# EAGLE board mmu6100cp (EAGLE 6.6.0)
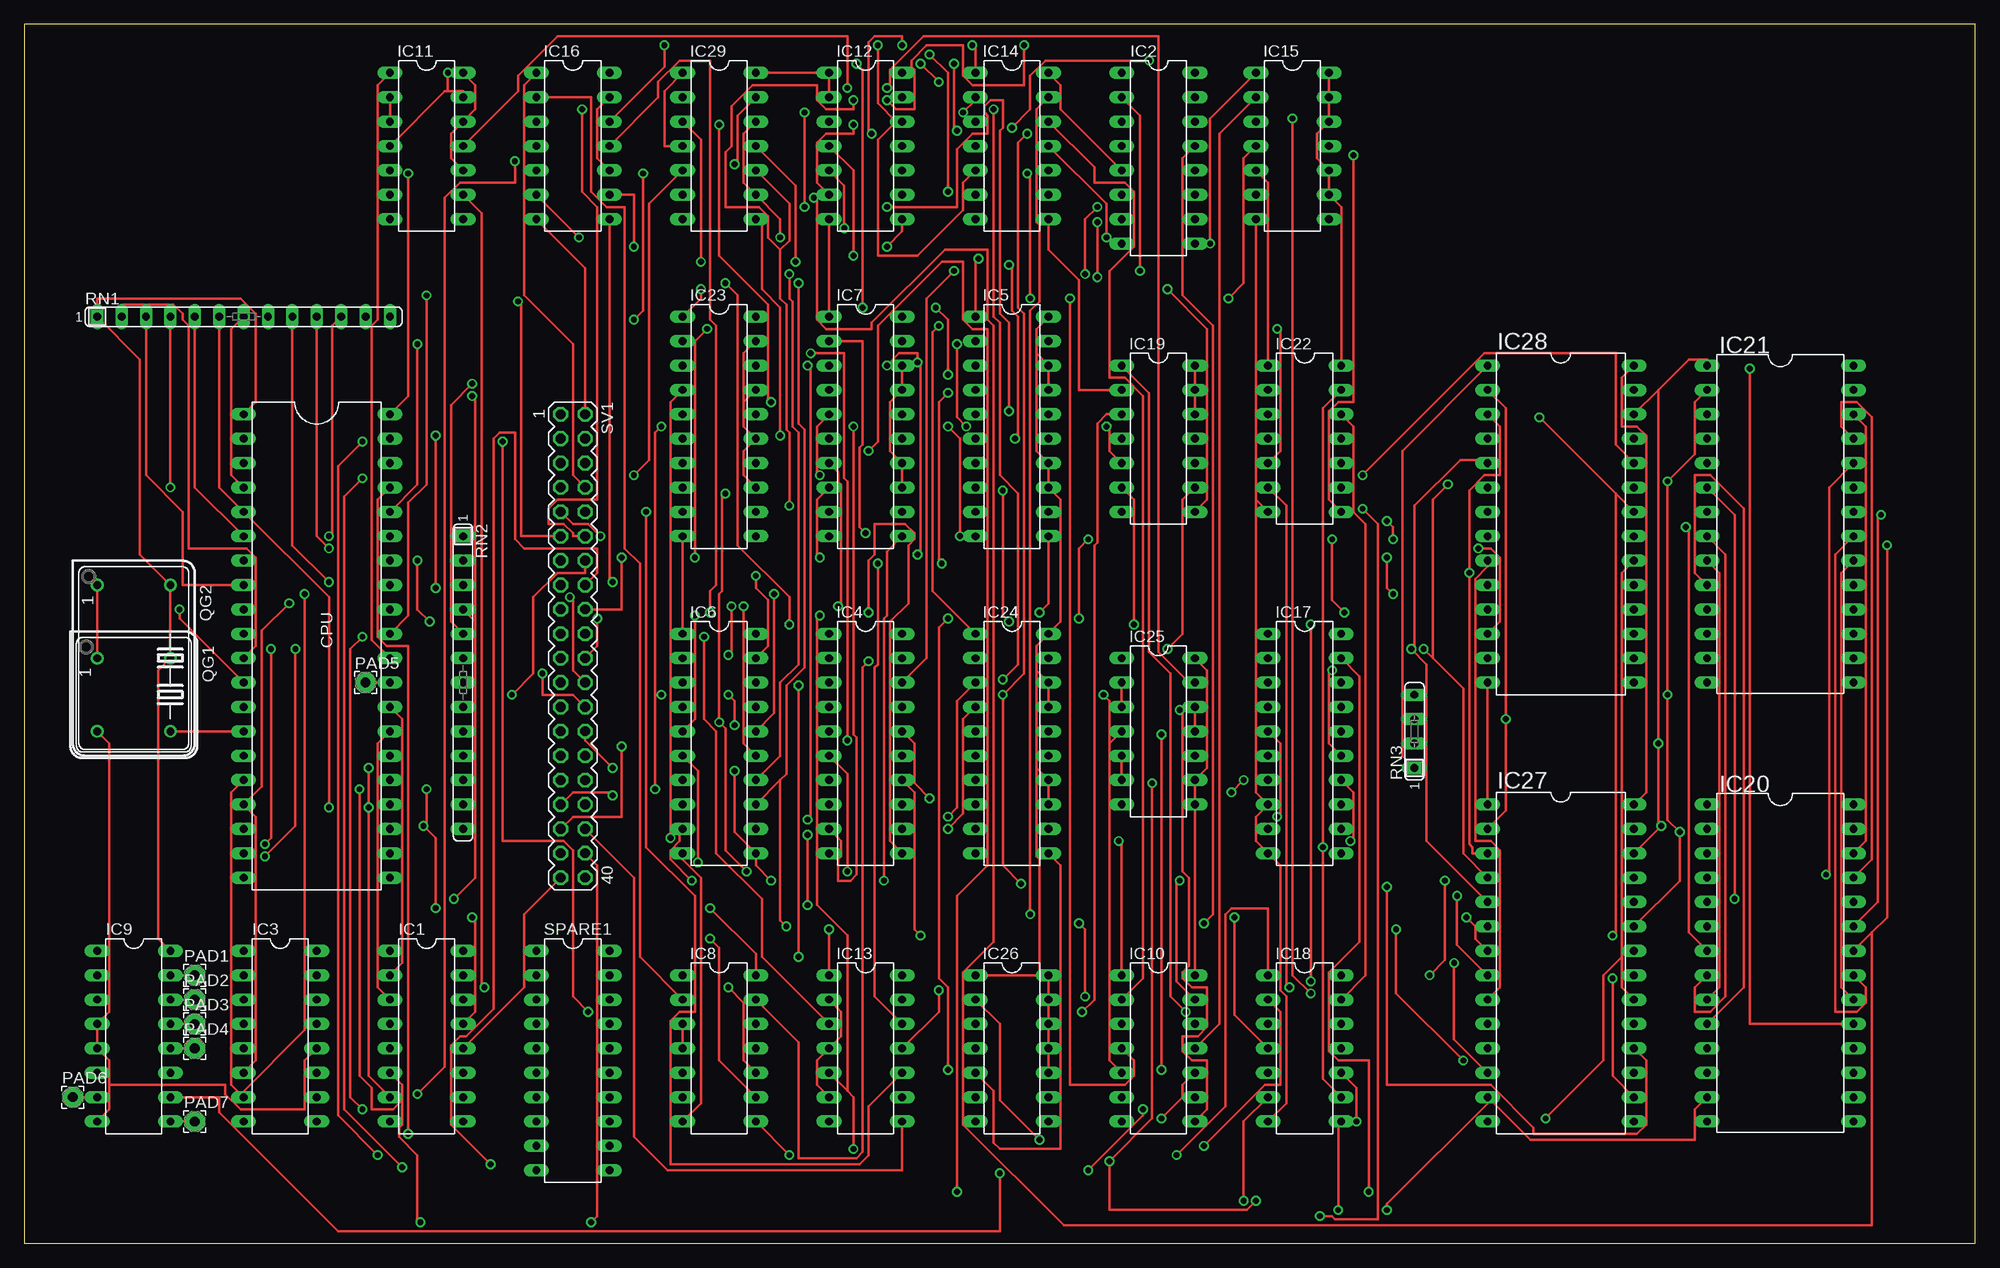
[diagram p3: board, top side]
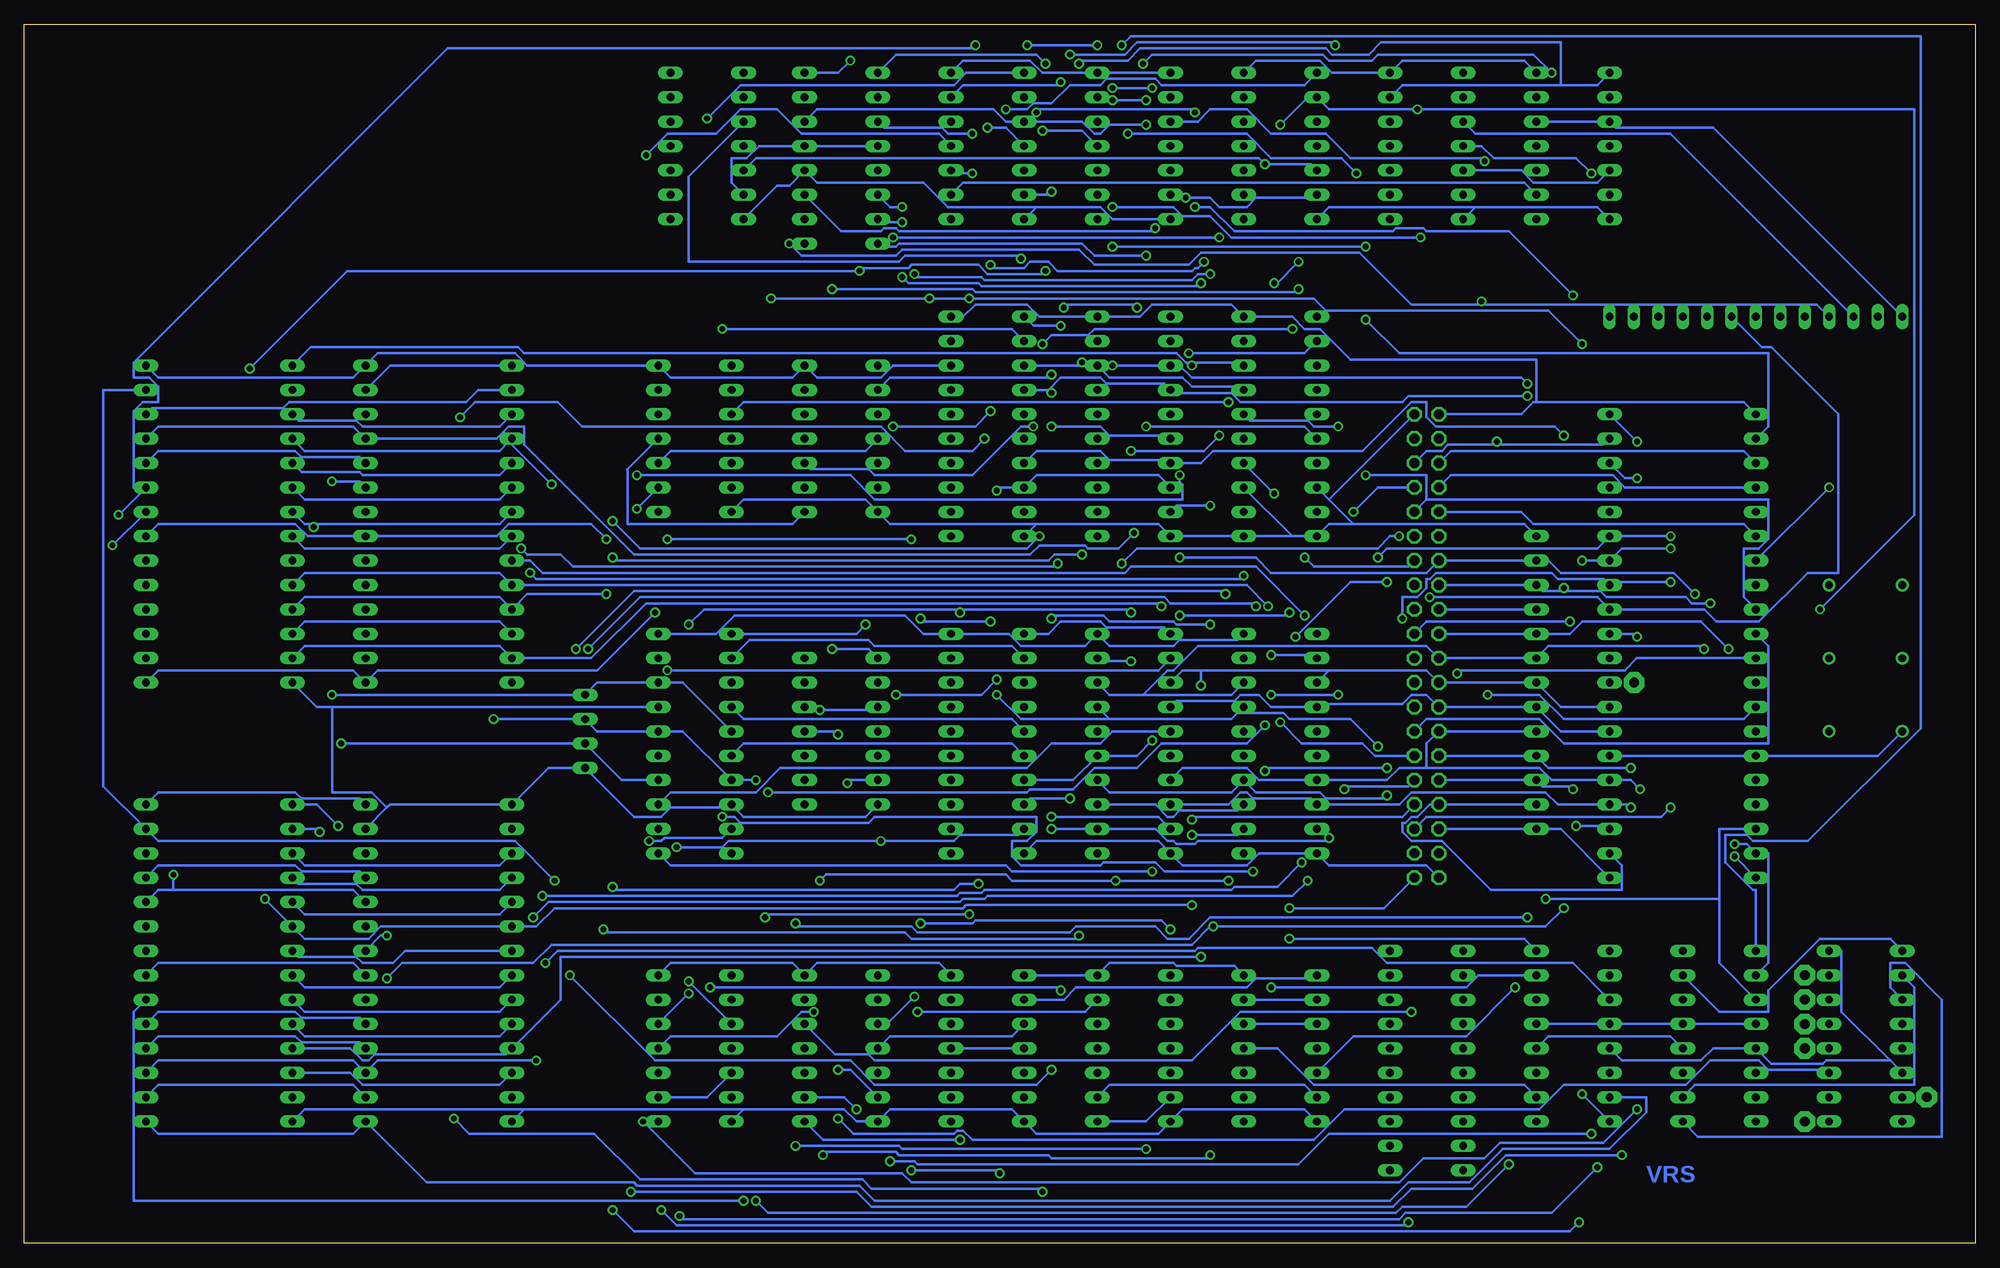
[diagram p4: board, bottom side, seen from below]

Size 203.2 x 127 mm. Coordinates in mm from the lower left corner, seen from the top.
Outline: 0,0 203.2,0 203.2,127 0,127 0,0
Copper layers (1*16): Top 0.035mm / dielectric 1.5mm / Bottom 0.035mm
Design rules "8mils *": minimum track width 10mil, minimum drill 24mil, track to track 8mil, track to pad 8mil, pad to pad 8mil, via to via 8mil, smd to smd 8mil, copper to edge 40mil, drill to drill 10mil, minimum pad ring 10mil, minimum via ring 8mil, stop-mask expansion 0mil, vias tented up to drill 0mil, thermal gap 10mil

## Footprints (pad centres in the part's own frame; a part is rotated, then mirrored left to right if it is on the bottom)
DIL40 = drill 0.813 long: 1 -24.13,-7.62; 2 -21.59,-7.62; 3 -19.05,-7.62; 4 -16.51,-7.62; 5 -13.97,-7.62; 6 -11.43,-7.62; 7 -8.89,-7.62; 8 -6.35,-7.62; 9 -3.81,-7.62; 10 -1.27,-7.62; 11 1.27,-7.62; 12 3.81,-7.62; 13 6.35,-7.62; 14 8.89,-7.62; 15 11.43,-7.62; 16 13.97,-7.62; 17 16.51,-7.62; 18 19.05,-7.62; 19 21.59,-7.62; 20 24.13,-7.62; 21 24.13,7.62; 22 21.59,7.62; 23 19.05,7.62; 24 16.51,7.62; 25 13.97,7.62; 26 11.43,7.62; 27 8.89,7.62; 28 6.35,7.62; 29 3.81,7.62; 30 1.27,7.62; 31 -1.27,7.62; 32 -3.81,7.62; 33 -6.35,7.62; 34 -8.89,7.62; 35 -11.43,7.62; 36 -13.97,7.62; 37 -16.51,7.62; 38 -19.05,7.62; 39 -21.59,7.62; 40 -24.13,7.62
DIL16 = drill 0.813 long: 1 -8.89,-3.81; 2 -6.35,-3.81; 3 -3.81,-3.81; 4 -1.27,-3.81; 5 1.27,-3.81; 6 3.81,-3.81; 7 6.35,-3.81; 8 8.89,-3.81; 9 8.89,3.81; 10 6.35,3.81; 11 3.81,3.81; 12 1.27,3.81; 13 -1.27,3.81; 14 -3.81,3.81; 15 -6.35,3.81; 16 -8.89,3.81
DIL20 = drill 0.813 long: 1 -11.43,-3.81; 2 -8.89,-3.81; 3 -6.35,-3.81; 4 -3.81,-3.81; 5 -1.27,-3.81; 6 1.27,-3.81; 7 3.81,-3.81; 8 6.35,-3.81; 9 8.89,-3.81; 10 11.43,-3.81; 11 11.43,3.81; 12 8.89,3.81; 13 6.35,3.81; 14 3.81,3.81; 15 1.27,3.81; 16 -1.27,3.81; 17 -3.81,3.81; 18 -6.35,3.81; 19 -8.89,3.81; 20 -11.43,3.81
DIL14 = drill 0.813 long: 1 -7.62,-3.81; 2 -5.08,-3.81; 3 -2.54,-3.81; 4 0,-3.81; 5 2.54,-3.81; 6 5.08,-3.81; 7 7.62,-3.81; 8 7.62,3.81; 9 5.08,3.81; 10 2.54,3.81; 11 0,3.81; 12 -2.54,3.81; 13 -5.08,3.81; 14 -7.62,3.81
DIL28-6 = drill 0.813 long: 1 -16.51,-7.62; 2 -13.97,-7.62; 3 -11.43,-7.62; 4 -8.89,-7.62; 5 -6.35,-7.62; 6 -3.81,-7.62; 7 -1.27,-7.62; 8 1.27,-7.62; 9 3.81,-7.62; 10 6.35,-7.62; 11 8.89,-7.62; 12 11.43,-7.62; 13 13.97,-7.62; 14 16.51,-7.62; 15 16.51,7.62; 16 13.97,7.62; 17 11.43,7.62; 18 8.89,7.62; 19 6.35,7.62; 20 3.81,7.62; 21 1.27,7.62; 22 -1.27,7.62; 23 -3.81,7.62; 24 -6.35,7.62; 25 -8.89,7.62; 26 -11.43,7.62; 27 -13.97,7.62; 28 -16.51,7.62
DIL28 = drill 0.813 long: 1 -16.51,-7.62; 2 -13.97,-7.62; 3 -11.43,-7.62; 4 -8.89,-7.62; 5 -6.35,-7.62; 6 -3.81,-7.62; 7 -1.27,-7.62; 8 1.27,-7.62; 9 3.81,-7.62; 10 6.35,-7.62; 11 8.89,-7.62; 12 11.43,-7.62; 13 13.97,-7.62; 14 16.51,-7.62; 15 16.51,7.62; 16 13.97,7.62; 17 11.43,7.62; 18 8.89,7.62; 19 6.35,7.62; 20 3.81,7.62; 21 1.27,7.62; 22 -1.27,7.62; 23 -3.81,7.62; 24 -6.35,7.62; 25 -8.89,7.62; 26 -11.43,7.62; 27 -13.97,7.62; 28 -16.51,7.62
2,15/1,0 = drill 1.016 pad 2.159 octagon: 1 0,0
DIL08S = drill 0.813: 1 -3.81,-3.81; 4 3.81,-3.81; 5 3.81,3.81; 8 -3.81,3.81
DIL14S = drill 0.813: 1 -7.62,-3.81; 7 7.62,-3.81; 8 7.62,3.81; 14 -7.62,3.81
SIL13 = drill 0.813 long: 1 -15.24,0; 2 -12.7,0; 3 -10.16,0; 4 -7.62,0; 5 -5.08,0; 6 -2.54,0; 7 0,0; 8 2.54,0; 9 5.08,0; 10 7.62,0; 11 10.16,0; 12 12.7,0; 13 15.24,0
SIL4 = drill 0.813 long: 1 -3.81,0; 2 -1.27,0; 3 1.27,0; 4 3.81,0
MA20-2 = drill 1.016 octagon: 1 -24.13,-1.27; 2 -24.13,1.27; 3 -21.59,-1.27; 4 -21.59,1.27; 5 -19.05,-1.27; 6 -19.05,1.27; 7 -16.51,-1.27; 8 -16.51,1.27; 9 -13.97,-1.27; 10 -13.97,1.27; 11 -11.43,-1.27; 12 -11.43,1.27; 13 -8.89,-1.27; 14 -8.89,1.27; 15 -6.35,-1.27; 16 -6.35,1.27; 17 -3.81,-1.27; 18 -3.81,1.27; 19 -1.27,-1.27; 20 -1.27,1.27; 21 1.27,-1.27; 22 1.27,1.27; 23 3.81,-1.27; 24 3.81,1.27; 25 6.35,-1.27; 26 6.35,1.27; 27 8.89,-1.27; 28 8.89,1.27; 29 11.43,-1.27; 30 11.43,1.27; 31 13.97,-1.27; 32 13.97,1.27; 33 16.51,-1.27; 34 16.51,1.27; 35 19.05,-1.27; 36 19.05,1.27; 37 21.59,-1.27; 38 21.59,1.27; 39 24.13,-1.27; 40 24.13,1.27

## Placement (x,y rotation side)
CPU  IM6100  [DIL40]  30.48,62.23 270 top
IC1  74LS75N  [DIL16]  41.91,21.59 270 top
IC2  74LS75N  [DIL16]  118.11,113.03 270 top
IC3  74LS75N  [DIL16]  26.67,21.59 270 top
IC4  74273N  [DIL20]  87.63,52.07 270 top
IC5  74273N  [DIL20]  102.87,85.09 270 top
IC6  74LS373N  [DIL20]  72.39,52.07 270 top
IC7  74LS373N  [DIL20]  87.63,85.09 270 top
IC8  74LS10N  [DIL14]  72.39,20.32 270 top
IC9  74LS138N  [DIL16]  11.43,21.59 270 top
IC10  74LS00N  [DIL14]  118.11,20.32 270 top
IC11  74LS74N  [DIL14]  41.91,114.3 270 top
IC12  74LS30N  [DIL14]  87.63,114.3 270 top
IC13  7407N  [DIL14]  87.63,20.32 270 top
IC14  74LS10N  [DIL14]  102.87,114.3 270 top
IC15  74LS08N  [DIL14]  132.08,114.3 270 top
IC16  74LS32N  [DIL14]  57.15,114.3 270 top
IC17  74LS241N  [DIL20]  133.35,52.07 270 top
IC18  74LS32N  [DIL14]  133.35,20.32 270 top
IC19  74LS32N  [DIL14]  118.11,83.82 270 top
IC20  62256  [DIL28-6]  182.88,29.21 270 top
IC21  62256  [DIL28-6]  182.88,74.93 270 top
IC22  74LS04N  [DIL14]  133.35,83.82 270 top
IC23  74LS241N  [DIL20]  72.39,85.09 270 top
IC24  74273N  [DIL20]  102.87,52.07 270 top
IC25  74LS02N  [DIL14]  118.11,53.34 270 top
IC26  74LS74N  [DIL14]  102.87,20.32 270 top
IC27  27512  [DIL28]  160.02,29.21 270 top
IC28  27512  [DIL28]  160.02,74.93 270 top
IC29  74LS00N  [DIL14]  72.39,114.3 270 top
PAD1  [2,15/1,0]  17.78,27.94 0 top
PAD2  [2,15/1,0]  17.78,25.4 0 top
PAD3  [2,15/1,0]  17.78,22.86 0 top
PAD4  [2,15/1,0]  17.78,20.32 0 top
PAD5  [2,15/1,0]  35.56,58.42 0 top
PAD6  [2,15/1,0]  5.08,15.24 0 top
PAD7  [2,15/1,0]  17.78,12.7 0 top
QG1  [DIL08S]  11.43,57.15 270 top
QG2  [DIL14S]  11.43,60.96 270 top
RN1  100K  [SIL13]  22.86,96.52 0 top
RN2  100K  [SIL13]  45.72,58.42 270 top
RN3  100K  [SIL4]  144.78,53.34 90 top
SPARE1  [DIL20]  57.15,19.05 270 top
SV1  [MA20-2]  57.15,62.23 270 top

## Tracks (layer width: path | path; a pad name or v marks a point on that pad's centre or on a via)
!00  (via drill 0.61)
  Top 0.254: IC16.9 63.5,109.22 v63.5,103.82 | v89.85,103.82 91.44,105.41 IC12.8
  Bottom 0.254: v89.85,103.82 v63.5,103.82
!00FLT  (via drill 0.61)
  Top 0.254: IC13.3 76.83,29.84 76.83,35.88 72.07,40.64 72.07,53.34 70.8,54.61 v70.8,63.18 | v61.28,68.9 60.96,69.22 IC16.8
  Bottom 0.254: v70.8,63.18 65.09,68.9 v61.28,68.9
!2X  (via drill 0.61)
  Top 0.254: IC16.12 66.67,122.56 v66.67,124.78 | v94.3,123.83 96.2,121.92 v96.2,109.54
  Bottom 0.254: v66.67,124.78 66.99,125.09 87.31,125.09 88.58,123.83 v94.3,123.83 | v96.2,109.54 96.52,109.22 IC14.6
!2XFLT  (via drill 0.61)
  Top 0.254: 85.72,15.88 86.36,15.24 v86.36,9.84 | 85.72,15.88 IC13.5 | v122.87,10.16 129.22,16.51 130.81,16.51 130.81,24.13 IC18.2 | IC16.11 66.04,119.38 66.04,120.97 68.26,123.19 71.44,123.19 71.44,96.2 72.07,95.57 72.07,68.58 71.44,67.94 v71.44,65.72 | v82.87,65.41 82.55,65.09 82.55,35.24 85.72,32.07 85.72,15.88
  Bottom 0.254: v86.36,9.84 111.76,9.84 112.08,10.16 v122.87,10.16 | v71.44,65.72 71.75,65.41 v82.87,65.41
!AND
  Top 0.254: PAD1.1 IC9.15
!BADHLT  (via drill 0.61)
  Top 0.254: v120.97,24.13 119.38,25.72 119.38,59.37 117.16,61.59 117.16,88.58 IC19.1
  Bottom 0.254: IC18.11 135.89,21.59 124.78,21.59 122.24,24.13 v120.97,24.13
!C0  (via drill 0.61)
  Top 0.254: v56.83,67.31 57.15,66.99 57.15,59.69 SV1.24
  Bottom 0.254: v56.83,67.31 39.37,67.31 CPU.32 28.26,66.04 26.99,64.77 22.54,64.77 17.46,69.85 14.29,69.85 14.29,86.36 21.27,93.34 22.23,93.34 RN1.8
!C1  (via drill 0.61)
  Top 0.254: v31.75,68.9 27.94,72.71 RN1.9 | SV1.22 59.69,62.23 v59.69,65.09
  Bottom 0.254: v31.75,68.9 37.78,68.9 CPU.33 38.73,69.22 43.5,69.22 44.13,69.85 56.2,69.85 56.83,69.22 57.15,69.22 57.15,68.26 58.1,67.31 59.69,67.31 v59.69,65.09
!C2  (via drill 0.61)
  Top 0.254: v31.75,72.39 30.48,73.66 RN1.10 | v42.23,64.77 40.96,66.04 v40.96,71.12
  Bottom 0.254: v31.75,72.39 36.83,72.39 CPU.34 v40.96,71.12 | SV1.20 57.15,64.77 v42.23,64.77
!CLRST  (via drill 0.61)
  Top 0.254: v95.25,95.57 94.61,94.93 94.61,67.94 IC24.1 | v99.38,102.55 99.06,102.23 IC5.1
  Bottom 0.254: IC4.1 84.45,64.14 90.49,64.14 91.12,64.77 95.25,64.77 96.52,63.5 IC24.1 | IC5.1 98.11,95.57 v95.25,95.57 | IC15.3 133.99,111.12 133.99,102.23 112.08,102.23 111.44,102.87 99.69,102.87 v99.38,102.55
!CPREQ  (via drill 0.61)
  Top 0.254: RN1.6 20.32,78.74 CPU.5 31.75,67.31 v31.75,45.4 | IC13.6 82.55,16.51 82.55,19.05 IC13.4 85.09,21.59 85.09,24.13 IC13.2 | SV1.36 63.5,38.1 63.5,11.11 66.99,7.62 91.44,7.62 IC13.8
  Bottom 0.254: IC13.6 86.36,12.7 IC13.8 | v31.75,45.4 32.7,44.45 57.15,44.45 SV1.36
!CPSEL  (via drill 0.61)
  Top 0.254: v35.24,79.69 33.34,77.79 33.34,13.97 v39.37,7.94 | v134.94,2.86 136.21,2.86 136.53,2.54 140.97,2.54 140.97,74.93 v139.38,76.52
  Bottom 0.254: CPU.38 36.51,79.69 v35.24,79.69 | v39.37,7.94 44.13,3.17 59.37,3.17 60.01,2.54 134.62,2.54 v134.94,2.86 | IC22.9 v139.38,76.52
!CPUDEVSEL  (via drill 0.61)
  Top 0.254: IC16.10 59.69,113.03 59.69,118.11 IC16.13 | CPU.30 36.2,62.87 36.2,95.57 36.83,96.2 36.83,120.65 IC11.1 | IC18.4 126.05,23.81 v126.05,33.97 | v104.78,34.29 104.78,97.16 105.73,98.11 105.73,106.05 105.41,106.36 105.41,118.11 IC14.13 | v95.25,120.97 v93.34,122.87
  Bottom 0.254: IC16.13 59.69,120.65 43.18,120.65 | 43.18,120.65 39.37,120.65 IC11.1 | v126.05,33.97 125.73,34.29 v104.78,34.29 | 43.18,120.65 43.18,125.09 61.91,125.09 63.18,123.83 66.99,123.83 67.63,124.46 87,124.46 88.27,123.19 93.03,123.19 v93.34,122.87 | v95.25,120.97 95.57,120.65 105.41,120.65 IC14.13
!CPUINTREQ
  Top 0.254: CPU.8 16.51,68.58 16.51,76.2 12.7,80.01 RN1.3
  Bottom 0.254: IC16.3 52.07,115.57 31.75,115.57 RN1.3
!CPUSWSEL  (via drill 0.61)
  Top 0.254: CPU.31 40.01,65.41 40.01,77.15 41.91,79.06 v41.91,98.74 | v81.28,117.79 v81.28,107.95 | v97.79,117.79 99.06,119.06 IC14.2 | IC18.10 138.75,16.19 v138.75,12.7 | v35.24,13.97 33.97,15.24 33.97,61.91 v35.24,63.18
  Bottom 0.254: v41.91,98.74 48.58,105.41 57.15,105.41 57.47,105.73 60.33,105.73 60.64,105.41 77.15,105.41 79.69,107.95 v81.28,107.95 | v81.28,117.79 81.6,118.11 97.47,118.11 v97.79,117.79 | v138.75,12.7 133.35,7.3 111.76,7.3 110.81,6.35 60.01,6.35 57.47,8.89 51.12,8.89 49.53,10.48 38.73,10.48 v35.24,13.97 | v35.24,63.18 35.56,63.5 CPU.31
!DCA
  Top 0.254: PAD4.1 IC9.12
!DEVSEL  (via drill 0.61)
  Top 0.254: IC18.6 127,12.7 v127,4.45 | v48.58,8.26 44.45,12.38 44.45,20.64 45.4,21.59 46.04,21.59 48.9,24.45 48.9,83.82 49.53,84.45 51.12,84.45 51.12,73.34 52.07,72.39 59.69,72.39 59.69,69.85 SV1.16
  Bottom 0.254: v127,4.45 125.73,3.17 60.33,3.17 59.69,3.81 53.02,3.81 v48.58,8.26
!DMAREQ
  Top 0.254: CPU.4 21.59,80.01 21.59,95.25 RN1.7
  Bottom 0.254: SV1.7 54.61,80.01 37.78,80.01 36.51,78.74 CPU.4
!ERROR  (via drill 0.61)
  Top 0.254: v83.82,32.7 IC13.1 | v109.86,33.34 110.49,32.7 v110.49,25.72
  Bottom 0.254: v83.82,32.7 84.77,33.66 104.14,33.66 104.46,33.34 v109.86,33.34 | v110.49,25.72 113.35,22.86 IC10.3
!INTCLR
  Top 0.254: IC10.11 124.46,22.86 124.46,115.57 IC15.2
!INTREQ  (via drill 0.61)
  Top 0.254: IC13.10 87.95,14.29 87.95,9.21 87,8.26 67.31,8.26 67.31,23.18 68.26,24.13 69.85,24.13 69.85,36.2 64.77,41.27 v64.77,76.2 | IC16.1 52.07,120.65 52.07,98.74 57.15,93.66 57.15,80.01 SV1.8
  Bottom 0.254: v64.77,76.2 62.23,78.74 SV1.8
!IOT
  Top 0.254: PAD7.1 IC9.9
!IR3  (via drill 0.61)
  Top 0.254: v88.9,124.78 88.9,118.75 90.81,116.84 | IC14.5 97.79,110.49 97.79,107.63 93.03,102.87 88.9,102.87 88.9,114.94 90.81,116.84 | 90.81,116.84 IC12.12
  Bottom 0.254: IC3.1 22.86,36.83 23.18,36.83 26.04,39.69 26.04,42.55 23.81,42.55 23.18,41.91 17.46,41.91 5.71,53.66 5.71,125.73 87.95,125.73 v88.9,124.78
!IR4  (via drill 0.61)
  Top 0.254: v97.16,115.89 96.84,116.2 v96.84,122.87
  Bottom 0.254: IC12.11 93.03,115.89 v97.16,115.89 | v96.84,122.87 97.79,123.83 112.39,123.83 IC2.1
!IR5  (via drill 0.61)
  Top 0.254: IC12.6 82.55,110.49 82.55,114.62 83.5,115.57 86.36,115.57 v86.36,116.52
  Bottom 0.254: v86.36,116.52 90.17,116.52 91.12,115.57 91.76,115.57 93.03,116.84 IC14.3 100.97,116.84 102.23,118.11 120.65,118.11 IC2.14
!IR6  (via drill 0.61)
  Top 0.254: IC12.5 85.41,110.17 v85.41,105.73
  Bottom 0.254: v85.41,105.73 85.72,105.41 112.08,105.41 112.39,105.73 113.67,105.73 113.98,105.41 118.11,105.41 IC2.11
!IR7  (via drill 0.61)
  Top 0.254: IC12.4 86.36,111.76 v86.36,102.87
  Bottom 0.254: v86.36,102.87 91.76,102.87 93.03,104.14 112.08,104.14 112.39,103.82 113.98,103.82 IC2.8
!IR8  (via drill 0.61)
  Top 0.254: v40.96,15.56 43.81,18.41 43.81,108.9 45.4,110.49 51.12,110.49 v51.12,112.71
  Bottom 0.254: v40.96,15.56 IC1.8 | v51.12,112.71 51.44,113.03 65.09,113.03 67.63,115.57 73.34,115.57 75.88,118.11 79.69,118.11 80.96,116.84 IC12.3
!ISZ
  Top 0.254: PAD3.1 IC9.13
!JMP  (via drill 0.61)
  Top 0.254: IC9.10 20.32,15.24 20.32,13.65 32.7,1.27 101.6,1.27 v101.6,7.3 | v110.81,7.62 116.52,13.34 v116.52,13.97
  Bottom 0.254: v101.6,7.3 101.92,7.62 v110.81,7.62 | v116.52,13.97 117.79,15.24 IC10.9
!JMP_OR_JMS  (via drill 0.61)
  Top 0.254: v119.06,61.91 120.65,63.5 120.65,77.47 IC19.9
  Bottom 0.254: IC25.1 115.25,61.91 v119.06,61.91
!JMS  (via drill 0.61)
  Top 0.254: v118.43,13.02 120.65,15.24 120.65,16.51 IC10.10
  Bottom 0.254: IC9.11 15.56,18.1 21.59,18.1 22.54,19.05 27.62,19.05 30.16,16.51 42.86,16.51 45.4,13.97 65.72,13.97 68.9,10.79 104.46,10.79 105.41,11.75 106.05,11.75 106.36,11.43 116.84,11.43 v118.43,13.02
!MEMFETCH  (via drill 0.61)
  Top 0.254: v118.43,53.02 v118.43,18.1 | IC25.11 IC25.12
  Bottom 0.254: IC10.6 117.16,18.1 v118.43,18.1 | v118.43,53.02 118.75,53.34 IC25.11
!MEMSEL  (via drill 0.61)
  Top 0.254: IC20.20 189.23,26.67 189.23,69.85 IC21.20 | IC25.5 IC25.6 | CPU.37 36.83,77.47 36.83,63.18 37.78,62.23 40.01,62.23 v40.01,11.43 | v117.47,47.94 117.47,13.02 v113.03,8.57 113.03,3.49 127.32,3.49 v128.27,4.45
  Bottom 0.254: v40.01,11.43 67.31,11.43 70.48,8.26 110.17,8.26 110.49,8.57 v113.03,8.57 | v117.47,47.94 117.16,48.26 IC25.6 | IC20.20 191.77,24.13 191.77,4.45 v128.27,4.45
!OE  (via drill 0.61)
  Top 0.254: 192.41,32.38 193.99,33.97 v193.99,72.71 | 192.41,32.38 IC20.22 | v82.23,108.9 82.55,108.58 82.55,96.2 83.5,95.25 88.27,95.25 88.27,95.89 95.89,103.5 100.33,103.5 100.33,96.2 100.97,95.57 100.97,31.43 97.79,28.26 97.79,12.38 108.27,1.91 192.41,1.91 192.41,32.38
  Bottom 0.254: IC21.22 v193.99,72.71 | IC29.6 68.9,108.9 74.93,108.9 75.88,107.95 78.74,107.95 79.69,108.9 v82.23,108.9
!OPR
  Top 0.254: PAD6.1 IC9.7
!RESET  (via drill 0.61)
  Top 0.254: RN1.4 v15.24,78.74 | IC15.1 123.51,117.16 v123.51,104.14 | SV1.11 51.75,73.66 51.75,97.79 v51.44,98.11
  Bottom 0.254: v15.24,78.74 CPU.7 | v123.51,104.14 122.24,102.87 112.39,102.87 111.76,103.5 93.34,103.5 91.76,101.92 81.92,101.92 80.64,103.19 64.14,103.19 58.74,97.79 51.44,97.79 | 51.44,97.79 16.51,97.79 RN1.4 | 51.44,97.79 v51.44,98.11
!RUNHLT  (via drill 0.61)
  Top 0.254: CPU.6 17.78,78.74 RN1.5 | IC13.12 88.58,25.72 88.58,60.01 88.9,60.33 v88.9,70.8 | v60.01,73.66 58.74,74.93 57.15,74.93 SV1.9
  Bottom 0.254: v88.9,70.8 87.31,72.39 62.23,72.39 60.96,73.66 v60.01,73.66 | CPU.6 24.13,74.93 46.04,74.93 47.31,76.2 SV1.9
!SETZF  (via drill 0.61)
  Top 0.254: IC11.4 43.81,120.02 44.13,120.02 | 44.13,120.02 45.72,120.02 IC11.13 | IC19.2 109.86,88.9 109.86,100.33 106.68,103.5 IC14.8 | v44.13,121.92 44.13,120.02 | v86.68,122.87 87.31,122.24 v87.31,97.47 | v94.93,97.47 96.2,96.2 v96.2,90.49
  Bottom 0.254: v44.13,121.92 46.04,123.83 62.23,123.83 62.87,123.19 67.31,123.19 67.94,123.83 85.72,123.83 v86.68,122.87 | v87.31,97.47 87.63,97.79 94.61,97.79 v94.93,97.47 | v96.2,90.49 96.52,90.17 113.03,90.17 IC19.2
!SKP  (via drill 0.61)
  Top 0.254: v31.75,73.66 32.07,73.98 32.07,95.57 RN1.11 | SV1.18 62.23,66.04 v62.23,71.44
  Bottom 0.254: v31.75,73.66 CPU.35 39.37,72.39 61.28,72.39 v62.23,71.44
!SWSEL  (via drill 0.61)
  Top 0.254: IC18.8 136.84,12.38 v136.84,3.49 | v59.05,2.22 59.69,2.86 59.69,39.37 SV1.38
  Bottom 0.254: v136.84,3.49 135.25,1.91 59.37,1.91 v59.05,2.22
!TAD
  Top 0.254: PAD2.1 IC9.14
!USEBF  (via drill 0.61)
  Top 0.254: IC23.1 70.48,98.42 v70.48,99.38 | v119.06,99.38 123.19,95.25 123.19,77.47 IC19.8
  Bottom 0.254: v70.48,99.38 70.8,99.06 104.14,99.06 104.46,99.38 v119.06,99.38 | IC22.11 140.34,80.64 140.34,74.93 123.19,74.93 IC19.8
!USER_MODE
  Top 0.254: IC18.13 139.7,27.94 139.7,74.93 138.43,76.2 138.43,85.09 IC22.12
!WAIT  (via drill 0.61)
  Top 0.254: CPU.11 24.13,62.23 24.13,71.44 23.18,72.39 17.14,72.39 17.14,95.57 16.51,96.2 16.51,96.84 15.56,97.79 10.16,97.79 RN1.2 | SV1.26 57.15,57.15 53.98,57.15 v53.98,59.37
  Bottom 0.254: v53.98,59.37 53.66,59.69 36.51,59.69 35.24,60.96 CPU.11
!WE  (via drill 0.61)
  Top 0.254: IC29.3 70.48,114.94 v70.48,102.23 | v73.03,100.01 74.3,98.74 74.3,72.71 79.69,67.31 v79.69,64.45 | v96.2,65.09 95.25,64.14 95.25,27.62 96.2,26.67 v96.2,18.1 | v146.37,27.94 147.96,29.53 v147.96,37.78
  Bottom 0.254: IC21.27 194.94,88.9 194.94,47.62 IC20.27 189.23,41.91 152.08,41.91 v147.96,37.78 | v70.48,102.23 72.71,100.01 v73.03,100.01 | v79.69,64.45 83.19,64.45 83.5,64.77 90.17,64.77 90.81,65.41 95.89,65.41 v96.2,65.09 | v96.2,18.1 97.79,16.51 114.62,16.51 117.16,19.05 137.48,19.05 v146.37,27.94
!XXX7  (via drill 0.61)
  Top 0.254: v79.69,9.21 IC8.8 | v120.02,9.21 125.09,14.29 125.09,34.29 125.73,34.92 129.54,34.92 IC18.1
  Bottom 0.254: v79.69,9.21 80.01,8.89 96.2,8.89 96.52,9.21 112.08,9.21 112.39,9.53 119.7,9.53 v120.02,9.21
BFLD0  (via drill 0.61)
  Top 0.254: v81.92,92.71 85.41,92.71 85.41,79.69 85.72,79.38 v85.72,52.39
  Bottom 0.254: IC24.7 93.98,48.26 IC4.15 87.31,50.8 v85.72,52.39 | IC23.2 69.85,92.71 v81.92,92.71
BFLD1  (via drill 0.61)
  Top 0.254: v96.2,43.18 97.79,44.77 97.79,54.61 IC24.4 | IC23.4 67.31,87.63 v67.31,42.23
  Bottom 0.254: v96.2,43.18 IC4.12 85.41,43.18 84.14,41.91 83.5,41.91 83.19,41.59 81.28,41.59 80.96,41.91 67.63,41.91 v67.31,42.23
BFLD2  (via drill 0.61)
  Top 0.254: v96.2,44.45 97.16,45.4 97.16,56.52 IC24.3 | v86.36,85.09 86.36,53.02 86.68,52.7 86.68,38.42 86.04,37.78 84.77,37.78 84.77,40.01 85.09,40.32 85.09,41.91 IC4.9
  Bottom 0.254: IC4.9 85.09,44.45 v96.2,44.45 | IC23.6 69.85,85.09 v86.36,85.09
CPSEL  (via drill 0.61)
  Top 0.254: IC29.12 74.93,115.57 74.93,110.49 IC29.9 78.74,106.68 v78.74,104.78 | IC22.8 135.89,77.47 135.89,86.68 136.84,87.63 138.43,87.63 v138.43,113.35 | v112.71,104.78 112.71,108.27 IC14.11
  Bottom 0.254: v138.43,113.35 136.21,115.57 131.13,115.57 128.59,118.11 124.78,118.11 122.24,115.57 107.95,115.57 IC14.11 | v112.71,104.78 v78.74,104.78
DATAF  (via drill 0.61)
  Top 0.254: CPU.40 40.01,88.27 v40.01,111.44 | IC17.19 139.06,59.05 139.06,31.43 135.89,28.26 135.89,20 136.84,19.05 140.02,19.05 v140.02,5.4 | v36.83,9.21 32.7,13.34 32.7,80.96 v35.24,83.5
  Bottom 0.254: v40.01,111.44 41.59,113.03 50.16,113.03 51.44,114.3 IC16.4 | v140.02,5.4 116.52,5.4 114.94,3.81 60.64,3.81 58.74,5.71 52.39,5.71 48.9,9.21 v36.83,9.21 | CPU.40 v35.24,83.5
DFLD0  (via drill 0.61)
  Top 0.254: IC4.6 85.72,48.9 v85.72,38.73
  Bottom 0.254: v85.72,38.73 100.33,38.73 100.97,39.37 135.89,39.37 IC17.11
DFLD1
  Bottom 0.254: IC4.5 89.85,53.34 91.12,52.07 96.2,52.07 98.74,49.53 124.46,49.53 127,46.99 135.89,46.99 IC17.13
DFLD2  (via drill 0.61)
  Top 0.254: v136.21,59.69 135.89,59.37 135.89,52.07 IC17.15
  Bottom 0.254: IC4.2 85.09,59.69 v136.21,59.69
DMAGNT
  Bottom 0.254: CPU.3 24.13,82.55 54.61,82.55 SV1.5
DX0  (via drill 0.61)
  Top 0.254: 22.54,15.56 21.59,16.51 21.59,46.99 CPU.16 | v82.87,71.44 82.55,71.75 82.55,77.47 IC7.8 | v137.48,65.72 136.21,66.99 v136.21,73.34 | v110.81,73.34 109.86,72.39 v109.86,65.09 | v102.55,64.77 101.92,65.41 v101.92,78.42 | 22.54,15.56 29.21,22.23 v29.21,67.63 | 22.54,15.56 IC3.7
  Bottom 0.254: IC21.15 189.23,59.69 168.91,59.69 IC28.15 166.37,59.69 143.51,59.69 v137.48,65.72 | IC7.8 85.09,80.01 97.79,80.01 IC5.8 101.6,78.74 v101.92,78.42 | v82.87,71.44 74.93,71.44 73.34,69.85 57.15,69.85 SV1.13 RN2.2 44.45,71.12 43.18,69.85 31.43,69.85 v29.21,67.63 | v110.81,73.34 v136.21,73.34 | v109.86,65.09 109.54,64.77 v102.55,64.77
DX1  (via drill 0.61)
  Top 0.254: IC3.6 24.13,19.05 24.13,44.45 CPU.17 24.77,47.62 24.77,63.82 v27.62,66.67 | IC7.7 84.77,80.33 84.77,79.38 85.09,79.06 85.09,66.67 v84.77,66.36 | v42.86,84.14 v42.86,68.26
  Bottom 0.254: SV1.15 RN2.3 45.09,67.94 42.86,67.94 | 42.86,67.94 39.05,67.94 38.42,67.31 30.16,67.31 29.53,66.67 v27.62,66.67 | IC5.7 97.79,82.55 91.12,82.55 90.17,81.6 84.14,81.6 IC7.7 80.64,81.28 79.38,82.55 63.82,82.55 58.74,87.63 57.15,87.63 57.15,86.04 56.2,85.09 43.81,85.09 v42.86,84.14 | IC21.13 173.99,62.23 153.67,62.23 IC28.13 144.15,60.96 138.43,66.67 85.09,66.67 v84.77,66.36 | v42.86,68.26 42.86,67.94
DX2  (via drill 0.61)
  Top 0.254: 46.99,64.77 RN2.4 | 46.99,64.77 46.99,38.1 v44.77,35.88 | v46.67,88.27 46.99,87.95 46.99,64.77 | IC28.12 153.67,64.77 153.67,71.44 152.72,72.39 v151.45,72.39 | v95.57,70.8 95.25,71.12 95.25,87.63 v96.2,88.58
  Bottom 0.254: IC28.12 153.67,64.77 173.99,64.77 IC21.12 | 96.52,88.9 95.25,90.17 91.12,90.17 90.49,89.53 84.45,89.53 IC7.4 83.5,88.58 77.47,88.58 76.52,87.63 59.69,87.63 59.05,88.27 v46.67,88.27 | IC5.4 96.52,88.9 | SV1.17 RN2.4 | IC3.3 26.67,29.21 26.67,35.88 | 26.67,35.88 26.67,43.18 CPU.18 | 26.67,35.88 v44.77,35.88 | v151.45,72.39 150.81,71.75 147.32,71.75 146.05,70.48 95.89,70.48 v95.57,70.8 | 96.52,88.9 v96.2,88.58
DX3  (via drill 0.61)
  Top 0.254: v89.85,91.44 91.12,92.71 93.03,92.71 v93.03,91.76 93.34,91.44 93.34,72.07 v93.03,71.75 | RN2.5 44.45,64.77 44.45,87.31 v46.67,89.53 | v25.08,41.59 25.72,42.23 v25.72,61.91 | v142.56,67.63 141.92,68.26 v141.92,71.44
  Bottom 0.254: IC21.11 173.99,67.31 153.67,67.31 IC28.11 150.81,67.63 v142.56,67.63 | IC3.2 21.59,29.21 21.59,40.64 CPU.19 23.81,41.59 v25.08,41.59 | SV1.19 RN2.5 42.23,63.5 40.96,64.77 28.57,64.77 v25.72,61.91 | v89.85,91.44 IC7.3 82.87,91.44 81.6,90.17 47.31,90.17 v46.67,89.53 | v93.03,91.76 93.34,91.44 IC5.3 | v141.92,71.44 141.6,71.12 96.52,71.12 95.89,71.75 v93.03,71.75
DX4  (via drill 0.61)
  Top 0.254: v25.08,40.32 28.26,43.5 v28.26,61.91 | IC2.2 116.2,117.47 v116.2,101.28 | v96.84,101.28 93.98,98.42 93.98,60.96 IC4.18 | IC20.19 179.71,22.86 v179.71,91.12
  Bottom 0.254: v25.08,40.32 CPU.20 | v28.26,61.91 28.57,62.23 44.45,62.23 RN2.6 SV1.21 57.15,62.23 80.96,62.23 83.5,59.69 84.14,59.69 86.68,57.15 | IC27.19 168.28,23.5 174.31,23.5 174.94,24.13 189.23,24.13 IC20.19 | IC6.18 77.47,57.15 86.68,57.15 | 86.68,57.15 90.17,57.15 IC4.18 | v96.84,101.28 97.16,100.97 102.87,100.97 103.82,101.92 110.81,101.92 111.12,101.6 115.89,101.6 v116.2,101.28 169.54,101.28 v179.71,91.12
DX5  (via drill 0.61)
  Top 0.254: v104.46,115.57 103.5,114.62 103.5,97.47 104.14,96.84 104.14,59.37 v101.92,57.15 101.92,39.37 v103.82,37.47 | IC27.18 168.91,19.05 168.91,12.38 167.96,11.43 157.16,11.43 157.16,12.06 152.72,16.51 141.92,16.51 v141.92,37.15 | SV1.35 57.15,44.45 62.23,44.45 v62.23,51.75
  Bottom 0.254: CPU.21 43.18,43.18 RN2.13 SV1.35 | IC27.18 168.28,20.95 174.31,20.95 174.94,21.59 189.23,21.59 IC20.18 | 76.83,55.24 77.47,54.61 90.17,54.61 | 76.83,55.24 IC6.17 | IC4.17 90.17,54.61 | IC2.3 113.67,116.2 107.63,116.2 107,115.57 v104.46,115.57 | v101.92,57.15 99.38,54.61 90.17,54.61 | v141.92,37.15 141.6,36.83 106.36,36.83 105.73,37.47 v103.82,37.47 | v62.23,51.75 65.09,54.61 71.44,54.61 72.07,55.24 76.83,55.24
DX6  (via drill 0.61)
  Top 0.254: v111.76,107.95 110.49,106.68 v110.49,100.97 | v79.69,100.97 79.69,98.42 80.01,98.11 80.01,85.09 80.64,84.45 80.64,60.33 78.74,58.42 78.74,50.8 IC6.14 | v149.86,19.05 142.88,26.04 v142.88,32.7 | v93.34,32.07 92.71,32.7 92.71,46.99 IC4.14 | SV1.33 57.15,46.99 61.28,46.99 v61.28,46.67
  Bottom 0.254: CPU.22 36.83,39.37 36.83,36.83 50.48,36.83 55.56,41.91 58.74,41.91 59.69,42.86 59.69,43.81 59.37,43.81 58.74,44.45 58.1,44.45 56.83,45.72 SV1.33 RN2.12 | IC20.17 189.23,19.05 168.91,19.05 IC27.17 166.37,19.05 v149.86,19.05 | IC4.14 90.17,46.99 77.47,46.99 IC6.14 74.93,46.99 68.26,46.99 67.63,46.35 61.59,46.35 v61.28,46.67 | IC2.6 113.03,107.95 v111.76,107.95 | v110.49,100.97 110.17,100.65 103.5,100.65 103.19,100.33 81.6,100.33 80.96,100.97 v79.69,100.97 | v142.88,32.7 142.56,32.38 111.44,32.38 110.81,31.75 93.66,31.75 v93.34,32.07
DX7  (via drill 0.61)
  Top 0.254: v41.91,47.31 41.91,43.81 v41.59,43.5 42.86,42.23 v42.86,34.92 | v111.76,100.65 v111.76,106.36 | v80.64,100.01 80.64,85.41 81.28,84.77 81.28,60.01 79.38,58.1 79.38,48.9 78.74,48.26 | IC6.13 78.74,48.26 | IC27.16 165.42,17.46 v165.42,27.62 | v79.38,33.02 78.74,33.66 78.74,48.26
  Bottom 0.254: CPU.23 38.42,43.5 v41.59,43.5 | v41.91,47.31 42.23,47.62 45.09,47.62 RN2.11 SV1.31 | IC27.16 168.91,16.51 189.23,16.51 IC20.16 | IC6.13 76.83,45.09 82.87,45.09 83.5,44.45 84.14,44.45 85.41,45.72 IC4.13 | IC2.7 113.98,106.36 v111.76,106.36 | v111.76,100.65 111.12,100.01 103.82,100.01 103.5,99.69 80.96,99.69 v80.64,100.01 | v165.42,27.62 163.83,29.21 150.18,29.21 148.27,31.11 81.6,31.11 79.69,33.02 v79.38,33.02 44.77,33.02 v42.86,34.92
DX8  (via drill 0.61)
  Top 0.254: IC1.7 35.88,17.46 v35.88,45.4 v35.88,49.53
  Bottom 0.254: IC20.15 189.23,11.43 168.91,11.43 IC27.15 161.29,6.35 139.7,6.35 139.38,6.03 116.2,6.03 114.62,4.45 60.96,4.45 59.05,6.35 52.7,6.35 49.21,9.84 38.1,9.84 34.29,13.65 34.29,15.24 IC1.7 | IC4.8 77.79,45.72 76.52,46.99 75.88,46.99 75.25,46.35 69.22,46.35 IC6.8 60.01,45.72 58.74,46.99 44.77,46.99 43.5,45.72 CPU.24 36.2,45.72 v35.88,45.4 | SV1.29 RN2.10 44.45,49.53 v35.88,49.53
DX9  (via drill 0.61)
  Top 0.254: 152.72,14.92 156.84,10.79 173.99,10.79 173.99,13.97 IC20.13 | IC1.6 39.37,16.51 39.37,14.92 | 39.37,14.92 38.42,13.97 36.2,13.97 36.2,16.19 34.92,17.46 v34.92,47.31 | 152.72,14.92 141.92,4.13 v141.92,3.49 | v41.27,2.22 40.96,2.54 40.96,9.21 39.05,11.11 39.05,12.06 39.37,12.38 39.37,14.92 | 152.72,14.92 IC27.13
  Bottom 0.254: RN2.9 SV1.27 57.15,52.07 57.15,49.53 | IC4.7 82.55,49.53 75.88,49.53 74.61,48.26 IC6.7 61.28,48.26 60.01,49.53 57.15,49.53 | v34.92,47.31 35.88,48.26 CPU.25 44.13,48.26 45.4,49.53 57.15,49.53 | v141.92,3.49 139.7,1.27 42.23,1.27 v41.27,2.22
DX10  (via drill 0.61)
  Top 0.254: IC1.3 36.83,26.67 36.83,52.07 CPU.27 | IC27.12 148.91,21.27 v148.91,29.21
  Bottom 0.254: IC4.4 83.19,56.52 77.15,56.52 76.52,57.15 74.61,57.15 73.34,55.88 IC6.4 68.26,56.2 59.69,56.2 58.74,57.15 57.15,57.15 SV1.25 RN2.8 43.18,53.34 CPU.27 | IC27.12 153.67,16.51 167.96,16.51 169.23,17.78 IC20.12 | v148.91,29.21 147.64,30.48 81.28,30.48 80.96,30.8 62.87,30.8 61.28,29.21 41.91,29.21 IC1.3
DX11  (via drill 0.61)
  Top 0.254: IC1.2 39.37,29.21 39.37,54.61 CPU.28 | v80.64,58.1 v80.64,29.84
  Bottom 0.254: CPU.28 43.18,55.88 RN2.7 SV1.23 57.15,59.69 67.31,59.69 | IC20.11 169.23,20.32 167.96,19.05 167.32,19.05 166.69,19.68 153.03,19.68 IC27.11 147.32,25.4 147.32,29.84 v80.64,29.84 | 67.31,59.69 IC6.3 | IC4.3 82.55,59.69 80.64,59.69 | 67.31,59.69 80.64,59.69 | 80.64,59.69 v80.64,58.1
EMA0  (via drill 0.61)
  Top 0.254: v138.11,41.91 138.43,42.23 138.43,46.99 IC17.14 | IC27.26 v170.5,43.5 170.18,43.81 v170.18,52.07 170.18,88.9 | 170.18,88.9 173.35,92.08 175.26,92.08 IC21.1 | 170.18,88.9 IC28.26 | v81.6,44.13 81.92,44.45 81.92,91.12 v81.6,91.44
  Bottom 0.254: IC17.9 130.49,42.23 136.53,42.23 136.84,41.91 v138.11,41.91 | IC17.14 140.97,48.26 RN3.2 v170.18,52.07 | v170.5,43.5 172.72,45.72 IC20.1 | IC23.18 76.52,91.76 81.6,91.76 | 81.6,91.76 82.23,91.76 83.19,92.71 151.13,92.71 151.76,93.34 173.35,93.34 IC21.1 | SV1.34 59.69,44.45 81.28,44.45 v81.6,44.13 | 81.6,91.76 v81.6,91.44
EMA1  (via drill 0.61)
  Top 0.254: v66.36,85.09 65.72,84.45 65.72,57.15 | v65.72,47.31 65.72,57.15 | IC20.26 191.77,41.91 191.77,85.09 IC21.26 | IC27.2 154.31,45.09 v154.31,54.61 154.31,87 IC28.2 | v66.36,57.15 65.72,57.15 | v73.34,57.15 73.98,56.52 v73.98,53.98 | v127,48.26 v125.73,46.99
  Bottom 0.254: IC23.16 75.56,85.72 69.53,85.72 68.9,85.09 v66.36,85.09 | v65.72,47.31 65.41,47.62 59.05,47.62 SV1.32 | v154.31,54.61 RN3.3 143.51,53.34 IC17.16 134.62,53.34 IC17.7 v127,48.26 | IC21.26 189.87,87 176.21,87 175.58,87.63 157.16,87.63 155.89,88.9 IC28.2 | v73.34,57.15 v66.36,57.15 | v73.98,53.98 75.88,52.07 84.77,52.07 87.31,49.53 91.76,49.53 93.98,47.31 98.42,47.31 98.74,46.99 v125.73,46.99
EMA2  (via drill 0.61)
  Top 0.254: v73.03,78.11 72.71,77.79 72.71,67.94 72.39,67.63 v72.39,54.29 73.03,53.66 73.03,40.96 v75.25,38.73 | IC27.23 172.4,37.78 v172.4,42.86 171.13,44.13 v171.13,57.15 v171.13,79.38 173.99,82.23 173.99,87.63 IC21.2 | v130.49,44.45 130.81,44.77 130.81,52.07 IC17.5
  Bottom 0.254: v73.03,78.11 IC23.14 | v72.39,54.29 70.17,52.07 63.82,52.07 62.55,50.8 SV1.30 | IC17.5 134.62,58.42 IC17.18 143.51,58.42 RN3.4 v171.13,57.15 | v172.4,42.86 172.72,43.18 IC20.2 | IC28.23 168.28,79.38 v171.13,79.38 | v75.25,38.73 84.45,38.73 85.41,39.69 90.81,39.69 91.12,39.37 99.38,39.37 100.33,40.32 100.33,41.91 98.74,41.91 97.79,42.86 97.79,44.45 114.62,44.45 115.25,43.81 128.59,43.81 129.22,44.45 v130.49,44.45
GND
  Top 0.254: IC9.8 8.89,13.97 8.89,16.51 | 8.89,16.51 8.89,19.05 IC9.5 IC9.4 8.89,24.13 8.89,52.07 QG2.7 | IC1.12 52.07,26.67 52.07,34.29 SV1.39 | 8.89,16.51 20.95,16.51 20.95,15.56 22.54,13.97 29.21,13.97 29.21,19.05 IC3.12 | IC8.7 70.48,14.61 70.48,38.1 68.58,40.01 IC6.10 | IC27.1 IC28.14 | IC28.1 143.51,82.55 143.51,50.8 RN3.1 | IC12.7 IC7.1 | IC7.13 IC7.14 90.17,82.55 90.17,87.63 IC7.17 IC7.18 | 74.93,87.63 74.93,85.09 IC23.15 74.93,82.55 74.93,80.01 IC23.13 | IC23.17 74.93,87.63 | IC23.19 74.93,92.71 74.93,87.63 | IC23.10 IC6.1 | IC16.7 58.42,101.6 SV1.2 | 128.27,77.47 IC15.7 | IC22.7 128.27,77.47 | 128.27,77.47 128.27,46.99 IC17.8 128.27,44.45 128.27,41.91 IC17.10 130.81,39.37 130.81,26.35 131.44,25.72 131.44,14.61 IC18.7
  Bottom 0.254: IC8.7 69.85,13.97 82.55,13.97 IC13.7 85.09,11.43 97.79,11.43 IC26.7 100.33,13.97 113.03,13.97 IC10.7 116.52,12.7 117.79,13.97 128.27,13.97 | 128.27,13.97 IC18.7 | 151.13,13.97 IC27.14 | 128.27,13.97 151.13,13.97 | IC20.14 173.99,13.97 151.13,13.97 | CPU.26 CPU.15 10.16,50.8 QG2.7 | IC24.10 97.79,41.91 85.09,41.91 IC4.10 82.55,39.37 75.88,39.37 74.61,40.64 IC6.10 67.31,39.37 57.15,39.37 SV1.39 | IC3.12 31.75,21.59 44.45,21.59 IC1.12 | 171.13,55.88 172.72,55.88 IC21.14 | 171.13,55.88 IC17.17 | IC25.7 115.57,44.45 128.27,44.45 IC17.8 129.86,45.4 135.89,45.4 136.84,44.45 139.7,44.45 RN3.1 148.59,49.53 IC27.1 165.1,45.72 165.42,45.4 | IC28.27 165.1,91.44 IC28.1 | 165.42,45.4 IC27.27 | 171.13,55.88 171.13,46.99 167,46.99 165.42,45.4 | IC15.7 124.78,110.17 123.51,110.17 IC2.12 120.65,110.49 109.54,110.49 107,107.95 97.79,107.95 | 97.79,107.95 IC14.7 | 97.79,107.95 91.12,107.95 89.85,106.68 IC12.7 | IC11.7 39.37,107.95 52.07,107.95 | IC16.7 52.07,107.95 | IC29.7 67.31,107.95 52.07,107.95 | RN2.1 46.99,74.93 64.77,74.93 | 64.77,74.93 67.31,74.93 IC23.10 71.12,73.66 | 71.12,73.66 IC23.11 IC7.10 85.09,74.93 97.79,74.93 | 64.77,74.93 67.31,77.47 | 67.31,77.47 IC23.8 | 71.12,73.66 IC23.13 | 97.79,74.93 IC5.10 | 97.79,74.93 113.03,74.93 IC19.7 115.57,77.47 128.27,77.47 IC22.7 | 67.31,77.47 SV1.2 | IC7.18 90.17,90.17 82.55,90.17 81.6,89.22 76.52,89.22 IC23.17
IFETCH  (via drill 0.61)
  Top 0.254: CPU.36 40.96,79.06 v40.96,93.66 | v125.41,98.42 127,100.01 127,113.03 IC15.4 | v104.46,111.44 104.78,111.12 v104.78,98.42 | IC10.4 115.57,19.05 115.57,17.46 114.62,16.51 108.9,16.51 v108.9,98.42
  Bottom 0.254: IC26.3 100.33,21.59 113.03,21.59 IC10.4 | v40.96,93.66 44.45,97.16 67.63,97.16 68.9,98.42 v104.78,98.42 v108.9,98.42 v125.41,98.42 | IC14.10 106.36,111.44 v104.46,111.44
IFLD0
  Bottom 0.254: IC24.6 100.33,52.07 128.27,52.07 IC17.6
IFLD1
  Bottom 0.254: IC24.5 100.33,54.61 128.27,54.61 IC17.4
IFLD2
  Bottom 0.254: IC24.2 100.33,62.23 114.62,62.23 115.25,62.87 127.64,62.87 IC17.2
INHIBIT  (via drill 0.61)
  Top 0.254: v87.95,60.64 87.31,60.01 87.31,9.53 86.68,8.89 80.64,8.89 80.64,20.95 IC8.13 | IC16.2 59.05,119.38 59.05,109.54 60.64,107.95 62.55,107.95 62.55,72.39 64.14,70.8 64.14,29.84 IC8.2
  Bottom 0.254: IC8.13 IC8.2 | IC4.19 91.12,60.64 v87.95,60.64
INTGNT  (via drill 0.61)
  Top 0.254: v58.74,24.13 57.15,25.72 57.15,40.96 56.2,41.91 49.85,41.91 v49.85,83.5
  Bottom 0.254: CPU.39 38.73,83.19 49.85,83.19 | 49.85,83.19 54.93,83.19 55.56,82.55 57.15,82.55 SV1.6 | IC10.12 118.75,19.68 115.25,19.68 114.62,19.05 81.6,19.05 76.52,24.13 v58.74,24.13 | 49.85,83.19 v49.85,83.5
IR0
  Bottom 0.254: IC9.3 8.89,26.67 8.89,29.21 7.3,29.21 3.49,25.4 3.49,11.11 28.89,11.11 IC3.9
IR1
  Bottom 0.254: IC9.2 6.35,26.67 6.35,16.51 29.21,16.51 IC3.10
IR2
  Bottom 0.254: IC9.1 8.89,31.75 16.19,31.75 21.59,26.35 21.59,24.13 26.67,24.13 IC3.15
IR4  (via drill 0.61)
  Top 0.254: v102.87,116.2 104.78,118.11 104.78,121.6 106.36,123.19 v117.16,123.19
  Bottom 0.254: IC14.4 100.97,116.2 v102.87,116.2 | v117.16,123.19 118.43,121.92 IC2.16
IR9
  Bottom 0.254: IC1.10 46.99,16.51 68.9,16.51 72.71,20.32 IC8.11
IR10  (via drill 0.61)
  Top 0.254: v73.34,26.67 74.93,25.08 74.93,19.05 IC8.10
  Bottom 0.254: IC1.15 51.75,27.94 53.02,26.67 v73.34,26.67
IR11  (via drill 0.61)
  Top 0.254: v71.44,31.75 72.39,30.8 72.39,19.05 IC8.9
  Bottom 0.254: IC1.16 46.99,31.75 v71.44,31.75
JMP_OR_JMS  (via drill 0.61)
  Top 0.254: IC25.2 IC25.3 | v105.73,10.79 101.6,14.92 101.6,22.86 IC26.2 | v120.33,55.56 120.65,55.24 120.65,38.73 121.28,38.1 121.28,28.89 120.65,28.26 120.65,27.62 121.6,26.67 123.19,26.67 123.19,22.54 122.24,21.59 120.65,21.59 120.65,20 121.6,19.05 123.19,19.05 123.19,13.97 IC10.8
  Bottom 0.254: IC8.1 68.9,27.62 74.93,27.62 75.88,26.67 93.66,26.67 94.93,25.4 IC26.2 | IC10.8 120.02,10.79 v105.73,10.79 | IC25.3 114.62,55.56 v120.33,55.56
JMPFLT
  Top 0.254: IC8.3 IC8.4
  Bottom 0.254: IC8.3 IC8.12
LINK
  Top 0.254: PAD5.1 CPU.29
LXMAR  (via drill 0.61)
  Top 0.254: v73.98,49.21 73.98,42.86 IC6.11 76.2,39.37 v77.79,37.78 | v61.28,49.53 58.42,52.39 SV1.28 | IC10.13 120.02,27.3 120.02,37.47 v120.33,37.78 | IC7.11 89.85,72.07 89.85,65.41 89.53,65.09 v89.53,37.78
  Bottom 0.254: v73.98,49.21 73.66,49.53 v61.28,49.53 | v120.33,37.78 119.7,38.42 100.97,38.42 100.33,37.78 v89.53,37.78 v77.79,37.78 | CPU.10 21.59,62.23 21.59,52.07 42.86,52.07 45.4,54.61 57.15,54.61 SV1.28
MA0  (via drill 0.61)
  Top 0.254: v79.69,76.83 79.69,84.45 79.38,84.77 79.38,97.79 78.74,98.42 78.74,103.5 | 78.74,103.5 79.69,104.46 79.69,108.27 IC29.10 | IC20.23 193.04,35.56 193.04,75.56 v193.36,75.88 | 78.74,103.5 77.47,104.78 77.47,107 76.52,107.95 73.03,107.95 73.03,113.67 73.66,114.3 73.66,118.43 75.88,120.65 82.55,120.65 82.55,119.06 83.5,118.11 86.36,118.11 v86.36,119.06 | v89.85,119.06 90.81,118.11 92.71,118.11 92.71,122.24 92.39,122.56 92.39,123.19 93.98,124.78 97.79,124.78 97.79,121.6 98.74,120.65 104.14,120.65 v104.14,124.78
  Bottom 0.254: IC7.9 83.19,76.83 v79.69,76.83 | v193.36,75.88 IC21.23 191.77,78.74 191.77,86.68 190.82,87.63 189.23,87.63 189.23,89.22 190.18,90.17 191.77,90.17 191.77,91.76 159.07,124.46 104.46,124.46 v104.14,124.78 | v89.85,119.06 v86.36,119.06
MA1  (via drill 0.61)
  Top 0.254: v96.2,85.09 97.47,83.82 v97.47,73.66 | v141.92,75.25 142.56,74.61 v142.56,73.34 | IC20.21 191.77,26.67 191.77,25.08 190.82,24.13 188.59,24.13 188.59,71.75 IC21.21
  Bottom 0.254: IC27.21 168.91,29.21 189.23,29.21 IC20.21 | IC21.21 189.23,74.93 174.94,74.93 173.67,73.66 IC28.21 153.99,73.66 152.72,74.93 144.15,74.93 v142.56,73.34 | IC7.6 84.14,84.14 90.17,84.14 91.12,85.09 v96.2,85.09 | v97.47,73.66 98.74,72.39 139.06,72.39 v141.92,75.25
MA2  (via drill 0.61)
  Top 0.254: IC7.5 82.55,85.09 82.55,80.33 v82.87,80.01 | v139.38,80.01 152.08,92.71 165.74,92.71 165.74,83.19 IC28.24 | v187.64,38.42 187.96,38.73 187.96,78.74 IC21.24
  Bottom 0.254: IC27.24 168.91,36.83 187.64,36.83 | 187.64,36.83 189.23,36.83 IC20.24 | IC28.24 168.28,81.92 174.31,81.92 174.94,82.55 189.23,82.55 IC21.24 | v82.87,80.01 82.87,79.38 82.55,79.06 82.55,77.47 114.62,77.47 117.16,80.01 v139.38,80.01 | v187.64,38.42 187.64,36.83
MA3  (via drill 0.61)
  Top 0.254: IC7.2 87.31,93.98 87.31,83.19 87,82.87 87,74.61 v87.63,73.98 | IC20.25 192.41,40.01 192.41,86.04 190.82,87.63 189.23,87.63 189.23,85.09 IC21.25
  Bottom 0.254: IC27.25 168.28,38.73 174.31,38.73 174.94,39.37 189.23,39.37 IC20.25 | IC21.25 189.23,85.09 168.91,85.09 IC28.25 153.99,83.82 152.72,85.09 151.13,85.09 151.13,83.19 139.7,71.75 98.42,71.75 97.47,72.71 92.71,72.71 92.39,72.39 89.22,72.39 v87.63,73.98
MA4  (via drill 0.61)
  Top 0.254: IC6.19 77.47,62.23 77.47,66.99 76.2,68.26 v76.2,69.53 | IC28.3 153.67,85.09 153.67,80.01 152.08,80.01 150.5,78.42 v150.5,69.85 150.5,41.59 150.81,41.27 150.81,40.64 IC27.3
  Bottom 0.254: IC27.3 153.67,39.37 173.99,39.37 IC20.3 | v76.2,69.53 76.52,69.22 149.86,69.22 v150.5,69.85 | IC21.3 174.62,85.72 168.59,85.72 167.96,85.09 153.67,85.09 IC28.3
MA5  (via drill 0.61)
  Top 0.254: IC6.16 78.11,55.24 v78.11,67.63 | 146.69,60.96 149.86,57.78 149.86,40.64 IC27.4 | 146.69,60.96 v145.73,61.91 | v148.27,79.06 146.69,77.47 146.69,60.96
  Bottom 0.254: 152.72,83.5 153.67,82.55 173.99,82.55 IC21.4 | v78.11,67.63 78.42,67.94 139.7,67.94 v145.73,61.91 | IC20.4 174.62,37.47 168.59,37.47 167.96,36.83 153.67,36.83 IC27.4 | v148.27,79.06 152.72,83.5 | 152.72,83.5 IC28.4
MA6  (via drill 0.61)
  Top 0.254: IC6.15 74.93,52.07 v74.93,66.36 | IC28.5 152.4,81.6 149.54,81.6 144.78,76.83 144.78,62.23 v144.46,61.91 146.05,60.33 146.05,41.91 IC27.5
  Bottom 0.254: IC27.5 153.67,34.29 173.99,34.29 IC20.5 | v74.93,66.36 75.25,66.67 83.82,66.67 84.45,67.31 139.06,67.31 v144.46,61.91 | IC21.5 174.31,80.33 168.28,80.33 167.96,80.01 153.67,80.01 IC28.5
MA7  (via drill 0.61)
  Top 0.254: v81.6,35.24 v81.6,42.55 | IC21.6 178.12,75.88 v178.12,35.88
  Bottom 0.254: IC28.6 153.67,77.47 173.99,77.47 IC21.6 | IC6.12 76.83,42.55 v81.6,42.55 | v81.6,35.24 105.09,35.24 105.41,34.92 147.96,34.92 149.86,33.02 IC27.6 166.05,33.02 167.32,31.75 173.99,31.75 IC20.6 v178.12,35.88
MA8  (via drill 0.61)
  Top 0.254: IC6.9 68.26,42.86 68.26,41.91 67.31,40.96 67.31,40.01 v69.53,37.78 | v150.18,33.97 151.13,33.02 151.13,31.75 IC27.7 | v173.04,74.61 173.35,74.3 173.35,32.38 IC20.7
  Bottom 0.254: IC28.7 153.67,74.93 173.04,74.93 | 173.04,74.93 173.99,74.93 IC21.7 | v69.53,37.78 71.12,36.2 102.87,36.2 103.19,35.88 105.41,35.88 105.73,35.56 148.59,35.56 v150.18,33.97 | IC20.7 174.62,29.84 168.59,29.84 167.96,29.21 164.78,29.21 163.51,30.48 IC27.7 | v173.04,74.61 173.04,74.93
MA9  (via drill 0.61)
  Top 0.254: IC6.6 70.17,49.21 v70.17,39.69 | v149.22,36.2 149.22,31.11 IC27.8 | IC21.8 177.16,71.75 177.16,25.72 175.58,24.13 173.99,24.13 173.99,26.67 IC20.8
  Bottom 0.254: IC28.8 153.67,72.39 173.99,72.39 IC21.8 | v70.17,39.69 72.71,37.15 77.15,37.15 77.47,36.83 103.19,36.83 103.5,36.51 105.73,36.51 106.05,36.2 v149.22,36.2 | IC20.8 173.99,26.67 153.67,26.67 IC27.8
MA10  (via drill 0.61)
  Top 0.254: IC21.9 176.53,69.85 176.53,26.67 IC20.9 | IC6.5 69.85,54.61 v69.85,65.41 | IC27.9 153.67,26.67 153.67,40.96 152.72,41.91 151.13,41.91 151.13,69.22 152.4,70.48 IC28.9
  Bottom 0.254: IC27.9 153.67,24.13 173.99,24.13 IC20.9 | v69.85,65.41 74.93,70.48 87.95,70.48 88.58,69.85 149.22,69.85 150.5,71.12 IC28.9
MA11  (via drill 0.61)
  Top 0.254: v73.34,61.28 73.66,61.59 v73.66,66.36 | IC20.10 179.07,26.67 179.07,76.52 175.58,80.01 173.99,80.01 173.99,69.85 IC21.10
  Bottom 0.254: IC27.10 153.67,21.59 173.99,21.59 IC20.10 | IC6.2 68.9,61.28 v73.34,61.28 | v73.66,66.36 75.88,68.58 IC28.10 153.67,69.85 173.99,69.85 IC21.10
MEMSEL  (via drill 0.61)
  Top 0.254: IC29.4 66.67,114.3 66.67,120.02 IC29.1 | IC10.5 113.03,19.05 113.03,52.07 | IC25.4 113.03,52.07 | v100.97,118.11 100.97,96.52 101.6,95.89 101.6,80.01 103.5,78.11 103.5,60.33 v101.92,58.74 | v112.39,57.15 113.03,56.52 113.03,52.07
  Bottom 0.254: IC29.1 69.85,120.65 84.77,120.65 85.41,121.28 90.49,121.28 91.12,120.65 94.3,120.65 96.2,118.75 98.11,118.75 98.74,118.11 v100.97,118.11 | v101.92,58.74 103.5,57.15 v112.39,57.15
N$2
  Top 0.254: QG2.1 QG1.1
N$3  (via drill 0.61)
  Top 0.254: IC2.13 120.65,113.03 120.65,98.74 123.83,95.57 123.83,34.29 v122.87,33.34 | v46.67,33.97 46.99,33.66 46.99,24.13 IC1.13
  Bottom 0.254: IC2.4 IC2.13 126.68,114.3 127.95,113.03 129.54,113.03 129.54,110.49 IC15.6 | IC3.4 IC3.13 IC1.4 IC1.13 | v122.87,33.34 122.56,33.02 110.81,33.02 110.17,32.38 94.3,32.38 93.66,33.02 85.41,33.02 84.14,31.75 81.92,31.75 79.69,33.97 v46.67,33.97
N$5  (via drill 0.61)
  Top 0.254: IC13.11 95.25,24.13 v95.25,26.35 | v131.76,26.67 131.44,26.99 131.44,76.83 IC22.6
  Bottom 0.254: v95.25,26.35 95.57,26.67 v131.76,26.67
N$6  (via drill 0.61)
  Top 0.254: IC11.11 51.44,120.02 51.44,121.6 55.56,125.73 85.72,125.73 v85.72,120.33 | v89.85,120.33 90.17,120.65 90.17,122.24 93.66,125.73 118.11,125.73 118.11,61.59 121.28,58.42 IC25.13
  Bottom 0.254: v89.85,120.33 v85.72,120.33
N$7  (via drill 0.61)
  Top 0.254: v110.17,24.13 111.44,25.4 111.44,72.71 111.76,73.03 111.76,85.41 112.71,86.36 IC19.3
  Bottom 0.254: IC13.13 92.71,24.13 v110.17,24.13
N$8  (via drill 0.61)
  Top 0.254: v57.78,104.78 IC16.6 | v89.85,107.95 97.16,107.95 97.16,113.98 98.74,115.57 100.33,115.57 100.33,117.47 100.01,117.79 100.01,118.43 100.65,119.06 101.92,119.06 101.92,116.2 101.6,115.89 101.6,96.84 102.55,95.89 v102.55,86.68 | v112.71,85.09 113.03,84.77 113.03,82.55 IC19.5
  Bottom 0.254: v57.78,104.78 77.47,104.78 79.69,107 82.55,107 83.5,107.95 v89.85,107.95 | v102.55,86.68 104.14,85.09 v112.71,85.09
N$9  (via drill 0.61)
  Top 0.254: IC27.20 166.37,26.67 166.37,29.84 | 166.37,29.84 166.37,69.85 IC28.20 | IC29.8 76.83,106.05 76.83,99.38 78.74,97.47 v78.74,84.14 | v87.95,82.55 88.9,83.5 88.9,95.57 95.57,102.23 97.79,102.23 97.79,96.2 98.74,95.25 100.33,95.25 100.33,39.37 97.16,36.2 v97.16,5.4 | v158.43,13.02 164.47,19.05 164.47,27.94 166.37,29.84
  Bottom 0.254: v78.74,84.14 80.33,82.55 v87.95,82.55 | v97.16,5.4 97.47,5.71 114.94,5.71 115.89,6.67 139.06,6.67 143.83,11.43 156.84,11.43 v158.43,13.02
N$10  (via drill 0.61)
  Top 0.254: IC19.6 115.57,77.47 v115.57,64.45
  Bottom 0.254: v115.57,64.45 116.52,63.5 IC17.1
N$11  (via drill 0.61)
  Top 0.254: IC29.11 80.33,110.17 v80.33,102.23 | v102.55,101.92 102.87,101.6 102.87,97.16 103.5,96.52 103.5,84.14 v103.19,83.82 | IC28.22 165.74,78.11 | 165.74,78.11 v157.8,86.04 | v165.42,32.07 165.74,32.38 165.74,78.11
  Bottom 0.254: v80.33,102.23 80.96,101.6 81.28,101.6 81.6,101.28 95.57,101.28 96.52,102.23 98.42,102.23 99.06,101.6 102.23,101.6 v102.55,101.92 | v103.19,83.82 104.46,82.55 111.44,82.55 113.98,85.09 145.1,85.09 147.64,87.63 156.21,87.63 v157.8,86.04 | IC27.22 166.05,32.07 v165.42,32.07
N$15
  Bottom 0.254: IC8.6 69.85,16.51 90.17,16.51 IC13.9
OSCOUT
  Top 0.254: CPU.14 QG2.8
POPR
  Top 0.254: IC10.2 116.52,27.62 116.52,88.27 114.62,90.17 113.03,90.17 113.03,101.28 115.57,103.82 115.57,109.54 114.62,110.49 111.44,110.49 111.44,112.08 IC14.12
RUN  (via drill 0.61)
  Top 0.254: v63.5,96.2 64.45,97.16 v64.45,111.44 | v88.27,115.57 87.95,115.89 87.95,125.09 88.58,125.73 91.44,125.73 v91.44,124.78 | v98.74,124.78 99.06,124.46 IC14.1 | v133.99,26.04 132.08,27.94 v132.08,117.16
  Bottom 0.254: CPU.2 21.59,85.09 21.59,92.71 60.01,92.71 v63.5,96.2 | v64.45,111.44 66.04,113.03 73.34,113.03 75.88,115.57 v88.27,115.57 | v98.74,124.78 v91.44,124.78 | v133.99,26.04 IC18.12 | v132.08,117.16 128.59,120.65 106.36,120.65 105.09,121.92 IC14.1
SETIF
  Top 0.254: IC26.5 100.97,15.88 100.97,10.48 101.6,9.84 107.95,9.84 107.95,39.37 IC24.11
SETST  (via drill 0.61)
  Top 0.254: IC4.11 90.17,41.91 90.17,64.77 92.08,66.67 92.08,72.71 92.71,73.34 92.71,73.98 91.76,74.93 88.58,74.93 88.58,71.75 87.95,71.12 v87.95,65.72 | v105.73,65.72 106.68,66.67 IC5.11 | v133.99,64.45 v133.99,27.3
  Bottom 0.254: v87.95,65.72 88.27,66.04 105.41,66.04 | v133.99,27.3 IC18.3 | v133.99,64.45 132.4,66.04 105.41,66.04 | 105.41,66.04 v105.73,65.72
UB  (via drill 0.61)
  Top 0.254: v94.3,46.35 92.71,47.94 92.71,52.07 IC4.16
  Bottom 0.254: IC24.8 98.42,46.35 v94.3,46.35
UIF  (via drill 0.61)
  Top 0.254: v130.49,95.25 130.81,94.93 130.81,82.55 IC22.5
  Bottom 0.254: IC5.2 100.33,95.25 v130.49,95.25
USEBF
  Bottom 0.254: IC19.4 115.57,82.55 135.89,82.55 IC22.10
USER_MODE  (via drill 0.61)
  Top 0.254: v113.98,41.91 114.3,41.59 IC10.1 | IC22.13 135.25,87 v135.25,41.27 135.25,17.14 IC18.9
  Bottom 0.254: IC24.9 99.69,42.55 105.73,42.55 106.36,41.91 v113.98,41.91 129.86,41.91 130.49,41.27 v135.25,41.27 | IC18.5 132.08,15.24 IC18.9
VCC  (via drill 0.61)
  Top 0.254: IC2.5 107.95,118.11 107.95,120.65 IC14.14 | IC12.2 IC12.1 IC29.14 | IC11.2 IC11.3 | IC11.10 44.45,113.03 44.45,115.57 IC11.12 46.99,118.11 46.99,120.65 IC11.14 | CPU.1 24.13,87.63 24.13,96.84 22.54,98.42 7.62,98.42 RN1.1 12.06,92.08 12.06,71.75 QG2.14 QG1.8 13.97,59.69 13.97,31.75 IC9.16 | IC10.14 IC25.8 IC25.9 123.19,49.53 123.19,59.69 IC25.14 | 105.73,27.94 IC26.14 IC26.13 IC26.12 IC26.11 IC26.10 | 105.73,27.94 IC26.1 | v71.44,34.92 76.2,30.16 IC8.14 | IC27.28 168.91,46.99 168.91,84.14 167.96,85.09 166.37,85.09 166.37,90.17 IC28.28 | IC15.14 IC15.13 IC15.12 134.62,115.57 134.62,113.03 IC15.10 IC15.9 137.16,107.95 IC22.14 | IC19.12 IC19.13 IC19.14 | IC5.17 IC5.18 105.41,92.71 | IC5.20 105.41,95.25 105.41,92.71 | 105.41,92.71 105.41,82.55 IC5.14 IC5.13 107.95,77.47 107.95,64.77 IC24.20 105.41,62.23 105.41,59.69 | IC24.13 IC24.14 105.41,49.53 | IC24.17 IC24.18 105.41,59.69 | 105.41,59.69 105.41,49.53 | 105.73,27.94 105.73,40.01 105.41,40.32 105.41,49.53
  Bottom 0.254: IC12.1 IC12.14 97.16,121.92 98.42,123.19 105.41,123.19 IC14.14 | IC11.14 46.99,123.19 59.69,123.19 IC16.14 66.99,121.92 68.26,123.19 74.93,123.19 IC29.14 | IC11.12 IC11.3 37.47,116.2 27.3,116.2 RN1.1 | 8.89,19.05 13.97,24.13 13.97,30.48 IC9.16 | 8.89,19.05 IC9.6 | 8.89,19.05 15.56,19.05 15.88,18.73 21.27,18.73 IC3.5 27.3,20.32 28.57,19.05 36.83,19.05 IC1.5 | CPU.1 24.13,87.63 45.72,87.63 | 45.72,87.63 46.04,87.63 47.31,86.36 SV1.1 | IC18.14 135.89,29.21 123.19,29.21 IC10.14 120.65,29.21 107.95,29.21 IC26.14 | IC26.11 IC26.4 | IC8.14 77.15,28.89 83.19,28.89 83.5,29.21 90.17,29.21 IC13.14 IC26.1 | SV1.40 61.59,34.92 v71.44,34.92 | IC27.28 168.28,46.35 174.31,46.35 174.94,46.99 189.23,46.99 IC20.28 | IC21.28 189.23,90.17 168.91,90.17 IC28.28 166.37,92.71 152.08,92.71 150.81,91.44 IC22.14 135.89,90.17 123.19,90.17 IC19.14 120.65,90.17 113.98,90.17 112.71,91.44 IC5.18 | IC5.20 105.41,96.52 104.14,97.79 98.74,97.79 97.47,96.52 IC7.20 87,96.52 85.72,97.79 77.47,97.79 IC23.20 71.12,96.52 69.85,95.25 68.26,95.25 65.09,92.08 45.72,92.08 45.72,87.63 | IC6.20 76.83,62.87 82.87,62.87 83.5,62.23 90.17,62.23 IC4.20 92.71,62.23 99.38,62.23 100.65,63.5 IC24.20 109.54,63.5 111.44,65.41 129.22,65.41 131.13,63.5 IC17.20
WASMEM  (via drill 0.61)
  Top 0.254: v47.94,26.67 47.62,26.99 47.62,107.31 IC11.9
  Bottom 0.254: IC8.5 64.77,21.59 53.02,21.59 v47.94,26.67 | IC14.9 105.41,110.49 46.99,110.49 IC11.9
XTA  (via drill 0.61)
  Top 0.254: v73.98,112.39 74.3,112.71 74.3,117.47 IC29.13 | IC15.5 129.54,110.49 IC22.1 | v63.5,80.01 65.09,81.6 65.09,108.27 IC29.5
  Bottom 0.254: CPU.9 24.13,67.31 24.13,72.39 22.54,72.39 21.59,73.34 21.59,77.47 57.15,77.47 | SV1.10 57.15,77.47 | IC29.5 69.22,112.39 v73.98,112.39 74.61,113.03 127,113.03 IC15.5 | 57.15,77.47 57.15,80.01 v63.5,80.01
XTB  (via drill 0.61)
  Top 0.254: CPU.12 16.19,65.09 v16.19,66.04 | v77.79,87.63 77.47,87.95 77.47,97.79 72.39,102.87 v72.39,116.52 | SV1.12 57.15,73.66 57.15,73.98 56.2,74.93 54.61,74.93 54.61,76.52 55.56,77.47 59.69,77.47 59.69,107.95 58.1,109.54 v58.1,118.11
  Bottom 0.254: v16.19,66.04 6.35,75.88 6.35,118.11 v58.1,118.11 67.31,118.11 IC29.2 69.53,119.38 v72.39,116.52 | IC22.3 128.27,87.63 v77.79,87.63
XTC  (via drill 0.61)
  Top 0.254: v50.8,57.15 53.02,59.37 53.02,67.31 55.56,69.85 58.42,69.85 SV1.14 | v98.11,85.09 97.16,86.04 v97.16,93.66 | v71.12,95.25 69.85,93.98 v69.85,71.44
  Bottom 0.254: CPU.13 24.13,54.61 42.86,54.61 45.4,57.15 v50.8,57.15 | IC19.10 121.28,80.64 115.25,80.64 114.62,80.01 104.46,80.01 99.38,85.09 v98.11,85.09 | v97.16,93.66 96.2,94.61 92.39,94.61 91.76,95.25 v71.12,95.25 | v69.85,71.44 68.9,70.48 59.05,70.48 SV1.14
ZF
  Bottom 0.254: IC11.5 39.37,110.49 46.04,110.49 47.31,111.76 IC16.5

## Text on the board
Bottom: VRS